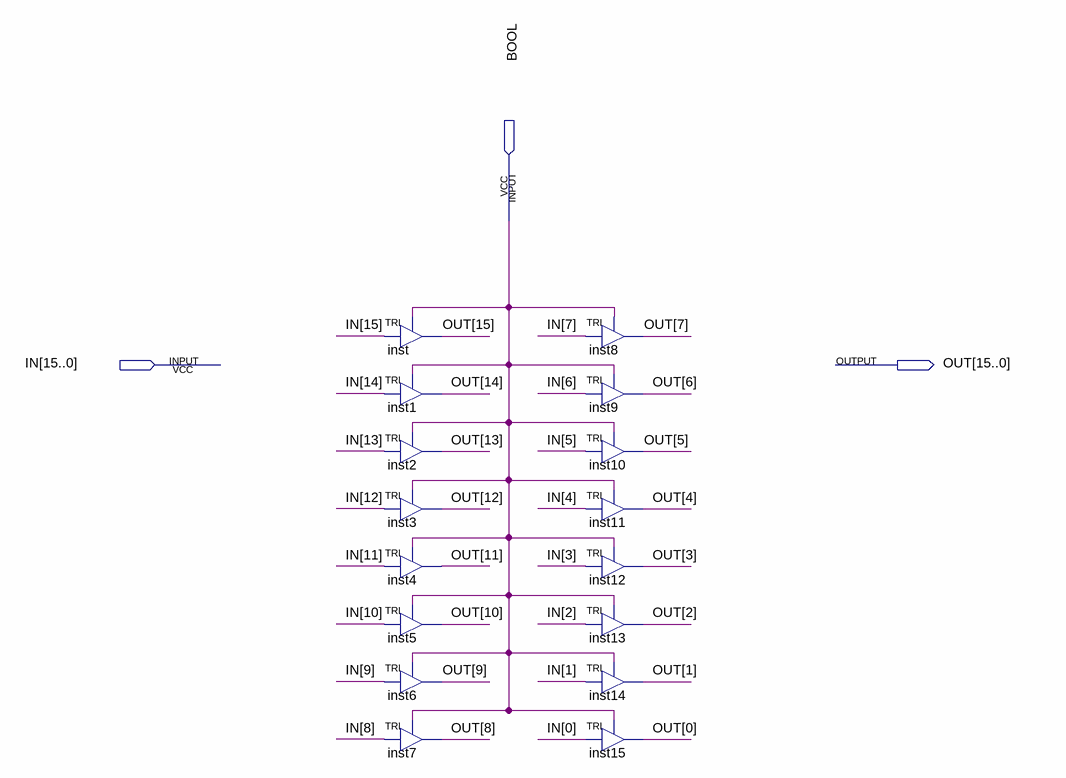
[diagram p0: schematic sheet]
// Quartus schematic TRI_16b.bdf as structural Verilog: 16 symbols, 3 pins
module TRI_16b (
  input  BOOL,
  input  [15:0] IN,
  output [15:0] OUT
);

  TRI inst (.IN(IN[15]), .OE(BOOL), .OUT(OUT[15]));
  TRI inst1 (.IN(IN[14]), .OE(BOOL), .OUT(OUT[14]));
  TRI inst2 (.IN(IN[13]), .OE(BOOL), .OUT(OUT[13]));
  TRI inst3 (.IN(IN[12]), .OE(BOOL), .OUT(OUT[12]));
  TRI inst4 (.IN(IN[11]), .OE(BOOL), .OUT(OUT[11]));
  TRI inst5 (.IN(IN[10]), .OE(BOOL), .OUT(OUT[10]));
  TRI inst6 (.IN(IN[9]), .OE(BOOL), .OUT(OUT[9]));
  TRI inst7 (.IN(IN[8]), .OE(BOOL), .OUT(OUT[8]));
  TRI inst8 (.IN(IN[7]), .OE(BOOL), .OUT(OUT[7]));
  TRI inst9 (.IN(IN[6]), .OE(BOOL), .OUT(OUT[6]));
  TRI inst10 (.IN(IN[5]), .OE(BOOL), .OUT(OUT[5]));
  TRI inst11 (.IN(IN[4]), .OE(BOOL), .OUT(OUT[4]));
  TRI inst12 (.IN(IN[3]), .OE(BOOL), .OUT(OUT[3]));
  TRI inst13 (.IN(IN[2]), .OE(BOOL), .OUT(OUT[2]));
  TRI inst14 (.IN(IN[1]), .OE(BOOL), .OUT(OUT[1]));
  TRI inst15 (.IN(IN[0]), .OE(BOOL), .OUT(OUT[0]));
endmodule
